# Altium schematic sheet Sheet (STM8S003F3P6).SchDoc
size Letter
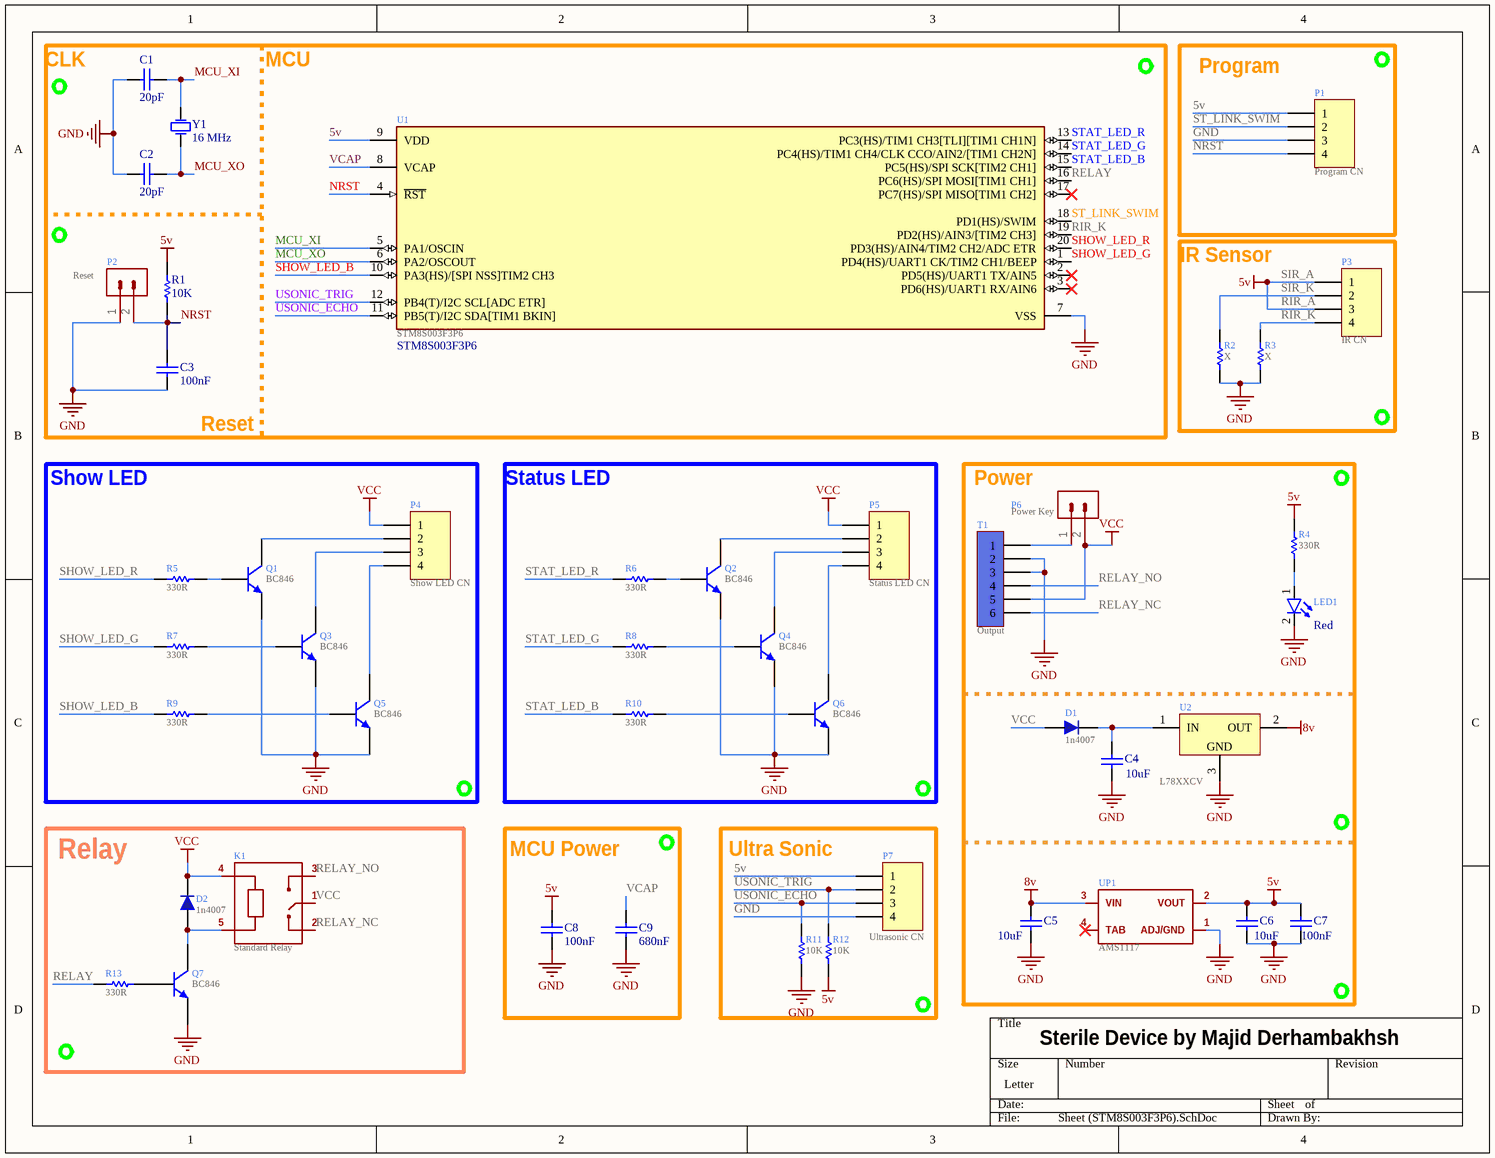
[diagram p0: Sheet (STM8S003F3P6).SchDoc]

## Parts
C1  20pF  [CAP805]
C2  20pF  [CAP805]
C3  100nF  [Cap1206_(3216X15L)]
C4  10uF  [Cap1206_(3216X15)]
C5  10uF  [Cap1206_(3216X15)]
C6  10uF  [Cap1206_(3216X15)]
C7  100nF  [Cap1206_(3216X15)]
C8  100nF  [Cap1206_(3216X15L)]
C9  680nF  [Cap1206_(3216X15L)]
D1  1n4007  [DIOM4629X24N]
D2  1n4007  [DIOM4629X24N]
K1  Standard Relay  [Milon Relay (18.85x15.35x15.70)]
LED1  Red  [LED SMD 1206]
P1  Program CN  [HDR1X4]
P2  Reset  [HDR 1X2 DIP TOP]
P3  IR CN  [HDR1X4]
P4  Show LED CN  [HDR1X4]
P5  Status LED CN  [HDR1X4]
P6  Power Key  [HDR 1X2 DIP TOP]
P7  Ultrasonic CN  [HDR1X4]
Q1  BC846  [SOT23_L]
Q2  BC846  [SOT23_L]
Q3  BC846  [SOT23_L]
Q4  BC846  [SOT23_L]
Q5  BC846  [SOT23_L]
Q6  BC846  [SOT23_L]
Q7  BC846  [SOT23_L]
R1  10K  [RES1206 _(3216X08L)]
R2  X  [RES1206 _(3216X08L)]
R3  X  [RES1206 _(3216X08L)]
R4  330R  [RES1206 _(3216X08L)]
R5  330R  [RES1206 _(3216X08L)]
R6  330R  [RES1206 _(3216X08L)]
R7  330R  [RES1206 _(3216X08L)]
R8  330R  [RES1206 _(3216X08L)]
R9  330R  [RES1206 _(3216X08L)]
R10  330R  [RES1206 _(3216X08L)]
R11  10K  [RES1206 _(3216X08L)]
R12  10K  [RES1206 _(3216X08L)]
R13  330R  [RES1206 _(3216X08L)]
T1  Output  [KF301-6PIN]
U1  STM8S003F3P6  [STMicroelectronics_STM8S003F3P6_0]
U2  L78XXCV  [78XXCV - Right]
UP1  AMS1117  [SOT223]
Y1  16 MHz  [XTAL 16MHZ]

## Blocks framed on the sheet
Program: P1
IR Sensor: P3 R2 R3
Show LED: P4 Q1 Q3 Q5 R5 R7 R9
Status LED: P5 Q2 Q4 Q6 R6 R8 R10
Power: C4-C7 D1 LED1 P6 R4 T1 U2 UP1
Relay: D2 K1 Q7 R13
MCU Power: C8 C9
Ultra Sonic: P7 R11 R12

## Nets
5v: C6.2 C7.2 C8.2 P1.1 P3.1 P3.3 P7.1 R1.2 R4.2 R12.1 U1.9(VDD) UP1.2(VOUT)  [also labelled RIR_A, SIR_A]
8v: C5.2 U2.2(OUT) UP1.3(VIN)
GND: C1.2 C2.2 C3.1 C4.1 C5.1 C6.1 C7.1 C8.1 C9.1 LED1.2(K) P1.3 P2.1 P7.4 Q1.2(E) Q2.2(E) Q3.2(E) Q4.2(E) Q5.2(E) Q6.2(E) Q7.2(E) R2.2 R3.2 R11.1 T1.2 T1.3 U1.7(VSS) U2.3(GND) UP1.1(ADJ/GND)
VCC: D1.1 D2.2 K1.1(COM) K1.4(A) P4.1 P5.1 P6.2 T1.5
MCU_XI: C1.1 U1.5(PA1/OSCIN) Y1.2(OSC2)
MCU_XO: C2.1 U1.6(PA2/OSCOUT) Y1.1(OSC1)
NRST: C3.2 P1.4 P2.2 R1.1 U1.4(~{RST})
RELAY: R13.1 U1.16(PC6(HS)/SPI_MOSI[TIM1_CH1])
RELAY_NC: K1.2(N.C) T1.6
RELAY_NO: K1.3(N.O) T1.4
RIR_K: P3.4 R3.1 U1.19(PD2(HS)/AIN3/[TIM2_CH3])
SHOW_LED_B: R9.1 U1.10(PA3(HS)/[SPI_NSS]TIM2_CH3)
SHOW_LED_G: R7.1 U1.1(PD4(HS)/UART1_CK/TIM2_CH1/BEEP)
SHOW_LED_R: R5.1 U1.20(PD3(HS)/AIN4/TIM2_CH2/ADC_ETR)
SIR_K: P3.2 R2.1
ST_LINK_SWIM: P1.2 U1.18(PD1(HS)/SWIM)
STAT_LED_B: R10.1 U1.15(PC5(HS)/SPI_SCK[TIM2_CH1])
STAT_LED_G: R8.1 U1.14(PC4(HS)/TIM1_CH4/CLK_CCO/AIN2/[TIM1_CH2N])
STAT_LED_R: R6.1 U1.13(PC3(HS)/TIM1_CH3[TLI][TIM1_CH1N])
USONIC_ECHO: P7.3 R11.2 U1.11(PB5(T)/I2C_SDA[TIM1_BKIN])
USONIC_TRIG: P7.2 R12.2 U1.12(PB4(T)/I2C_SCL[ADC_ETR])
VCAP: C9.2 U1.8(VCAP)
NetC4_2: C4.2 D1.2 U2.1(IN)
NetD2_1: D2.1 K1.5(A) Q7.3(C)
NetLED1_1: LED1.1(A) R4.1
NetP4_2: P4.2 Q1.3(C)
NetP4_3: P4.3 Q3.3(C)
NetP4_4: P4.4 Q5.3(C)
NetP5_2: P5.2 Q2.3(C)
NetP5_3: P5.3 Q4.3(C)
NetP5_4: P5.4 Q6.3(C)
NetP6_1: P6.1 T1.1
NetQ1_1: Q1.1(B) R5.2
NetQ2_1: Q2.1(B) R6.2
NetQ3_1: Q3.1(B) R7.2
NetQ4_1: Q4.1(B) R8.2
NetQ5_1: Q5.1(B) R9.2
NetQ6_1: Q6.1(B) R10.2
NetQ7_1: Q7.1(B) R13.2

Not connected (* = marked no-connect by the designer): U1 2(PD5(HS)/UART1_TX/AIN5)* 3(PD6(HS)/UART1_RX/AIN6)* 17(PC7(HS)/SPI_MISO[TIM1_CH2])*; UP1 4(TAB)*

## Notes on the sheet
- CLK
- MCU
- (near C3) Reset
- Sterile Device by Majid Derhambakhsh

## Library data of the parts
C1-C3 C7-C9 = CAP SMD PACKAGE: TOTAL CAPACITOR SMD PACK; Designer: Majid Derhambakhsh; Desc.: CAP SMD TOTAL PACKAGES; Data: 2017-3-10
  C1 C2: VALUE: 20pF
  C3 C7 C8: VALUE: 100nF
  C9: VALUE: 680nF
C4-C6 = CAP SMD PACKAGE: TOTAL CAPACITOR SMD PACK; Designer: Abbas Basereh; Desc.: CAP SMD TOTAL PACKAGES; Data: 2017-3-10; VALUE: 10uF
D1 D2 = 1n4007 SMD M7: Standard Rectifiers; Part. No: M7; Manufacturer: DC COMPONENTS; Designer: Abbas Basereh; Link: http://www.tme.eu/en/details/m7/smd-universal-diodes/dc-components/; Link: https://www.aliexpress.com/item/Smd-tube-1n4007-m7-SMA/1213719741.html?spm=2114.01010208.3.1.ZyZ7bC&ws_ab_test=searchweb0_0,searchweb201602_4_10065_10068_10084_10083_10080_10082_10081_10060_10061_10062_10056_10055_10054_10059_10099_10078_10079_427_10073_10103_10102_10096_10052_10050_10051,searchweb201603_4&btsid=db2be5ca-e560-400a-b91c-484ab5ee228b; Data: 16-12-2016
K1 = Relay: Relay SPDT POWER NEEDLE; Designer: Ali Hafizi; Company: E.P.I.L; Design_Date: 2011/10/31
LED1 = LED: Designer: Saeid Jorablo; Organazation: ControTec; Adding Date: 1387/12/22; Color: Red; Size: SMD 1206
P1 P3-P5 P7 = Header 4: Header, 4-Pin; LatestRevisionDate: 17-Jul-2002; LatestRevisionNote: Re-released for DXP Platform.; Publisher: Altium Limited
P2 P6 = Header 2: Header, 2-Pin; LatestRevisionDate: 17-Jul-2002; LatestRevisionNote: Re-released for DXP Platform.; Publisher: Altium Limited
Q1-Q7 = BC846: NPN General-purpose Transistor; Published: 2017-1-6; LatestRevisionDate: 12-Dec-2006; LatestRevisionNote: IPC-7351 Footprint Added.; DatasheetVersion: 4-Feb-2002; PackageVersion: 2017-1-6; PackageReference: SOT23; Publisher: Abbas Basereh; PackageDescription: 3-Pin SOT-23 Package 0.95 mm Pitch, 2.3 mm Lead Span; ComponentLink1Description: Manufacturer Link; ComponentLink1URL: http://www.semiconductors.philips.com/; ComponentLink2Description: Datasheet; ComponentLink2URL: http://www.semiconductors.philips.com/acrobat/datasheets/BC846_BC847_BC848_5.pdf
R1-R3 R5-R13 = RES SMD PACKAGE: TOTAL SMD RESISTOR PACK; Designer: Abbas Basereh; Desc.: RES SMD PAKAGES; Data: 2017-3-10
R4 = RES SMD PACKAGE: TOTAL SMD RESISTOR PACK; Designer: Abbas Basereh; Desc.: RES SMD PAKAGES; Value: 330; Data: 2017-3-10
T1 = KF301-6Pin_Terminal: Terminal 6 Pin 250VAC 16A
U1 = STM8S003F3P6: IC STM8 STM8S Microcontroller IC 8-Bit 16MHz 8KB (8K x 8) FLASH 20-TSSOP; Manufacturer: STMicroelectronics; Voltage: 2.95V~5.5V; Category 9E07530Daf1645C0: Semiconductors and Actives; Category Bfeb72E1862F642C: 8 Bit; Number of I/O: 16; RAM Size: 1K x 8; Category Baf677Fc8B5C6131: Microcontrollers; Category C8D405Def9791313: Microprocessors; EEPROM Size: 128 x 8; Category C8Ce05C4F1091309: Uncategorized; helpURL: https://upverter.com/upn/revision/e4e66cee8d1878d0/; ComponentLink2Description: Datasheet; Temperature: -40°C to +85°C; Package: TSSOP20; Supplier 2: Mouser; Price: 0.582340417175; Supplier 1: Digi-Key; ComponentLink1URL: https://upverter.com/upn/revision/e4e66cee8d1878d0/; Supplier Part Number 2: 511-STM8S003F3P6; Supplier Part Number 1: 497-11946-5-ND; ComponentLink1Description: Upverter; ComponentLink2URL: https://upverter.com/datasheet/126c1e634755f0662c16ca44ab91d2703942146a.pdf; RoHS: TRUE; Program Memory Size: 8KB (8K x 8); Temperature Range High: +85°C; Digikey Description: IC STM8 STM8S Microcontroller IC 8-Bit 16MHz 8KB (8K x 8) FLASH 20-TSSOP; Digikey Part Number: 497-11946-5-ND; Mouser Part Number: 511-STM8S003F3P6; Lead Free: yes; Temperature Range Low: -40°C; Core Size: 8-Bit; Speed: 16MHz; Part Number: STM8S003F3P6
U2 = L78XXCV: Fixed Voltage Regulator; Designer: Saeid Jorablo; Company: ControTec; Adding Date: 1387/01/06; Voltage: *
UP1 = AMS1117: x.x Volt, 800mA Low-Dropout Linear Regulator, 4-pin SOT-223; Designer: Ali Hafizi; Data: 16-12-2016
Y1 = XTAL: XTAL Crystal; Designer: ABBAS BASEREH; Design Date: 2017-1-3; ComponentLink1Description: Datasheet; ComponentLink2Description: Reference; Mounting Technology: Surface Mount\Through-Hole; Value: 16 MHz; Status: Unreleased